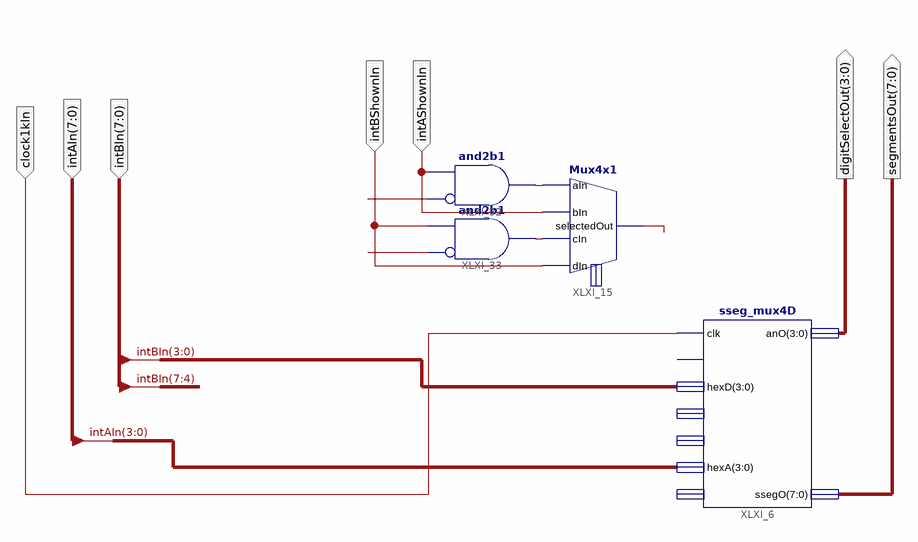
[diagram p0: schematic sheet 1]
// Xilinx ISE schematic Ssd2x2Hex.sch (spartan3e) as structural Verilog: 4 symbols, 7 ports
module Ssd2x2Hex (
  input  [7:0] intBIn,
  input  [7:0] intAIn,
  input  clock1kIn,
  input  intAShownIn,
  input  intBShownIn,
  output [3:0] digitSelectOut,
  output [7:0] segmentsOut
);

  wire XLXN_124, XLXN_125, XLXN_130, XLXN_131, XLXN_549;

  sseg_mux4D XLXI_6 (
    .clk(clock1kIn), .hexD(intBIn[3:0]), .hexA(intAIn[3:0]), .anO(digitSelectOut), .ssegO(segmentsOut));  // open: rb_in, hexC, hexB, dp_in
  Mux4x1 XLXI_15 (
    .selectedOut(XLXN_549), .aIn(XLXN_124), .bIn(intAShownIn), .cIn(XLXN_125), .dIn(intBShownIn));  // open: selectIn
  and XLXI_33 (XLXN_125, ~XLXN_130, intBShownIn);  // and2b1
  and XLXI_32 (XLXN_124, ~XLXN_131, intAShownIn);  // and2b1
endmodule
